# EAGLE design emu (EAGLE 8.2.1)
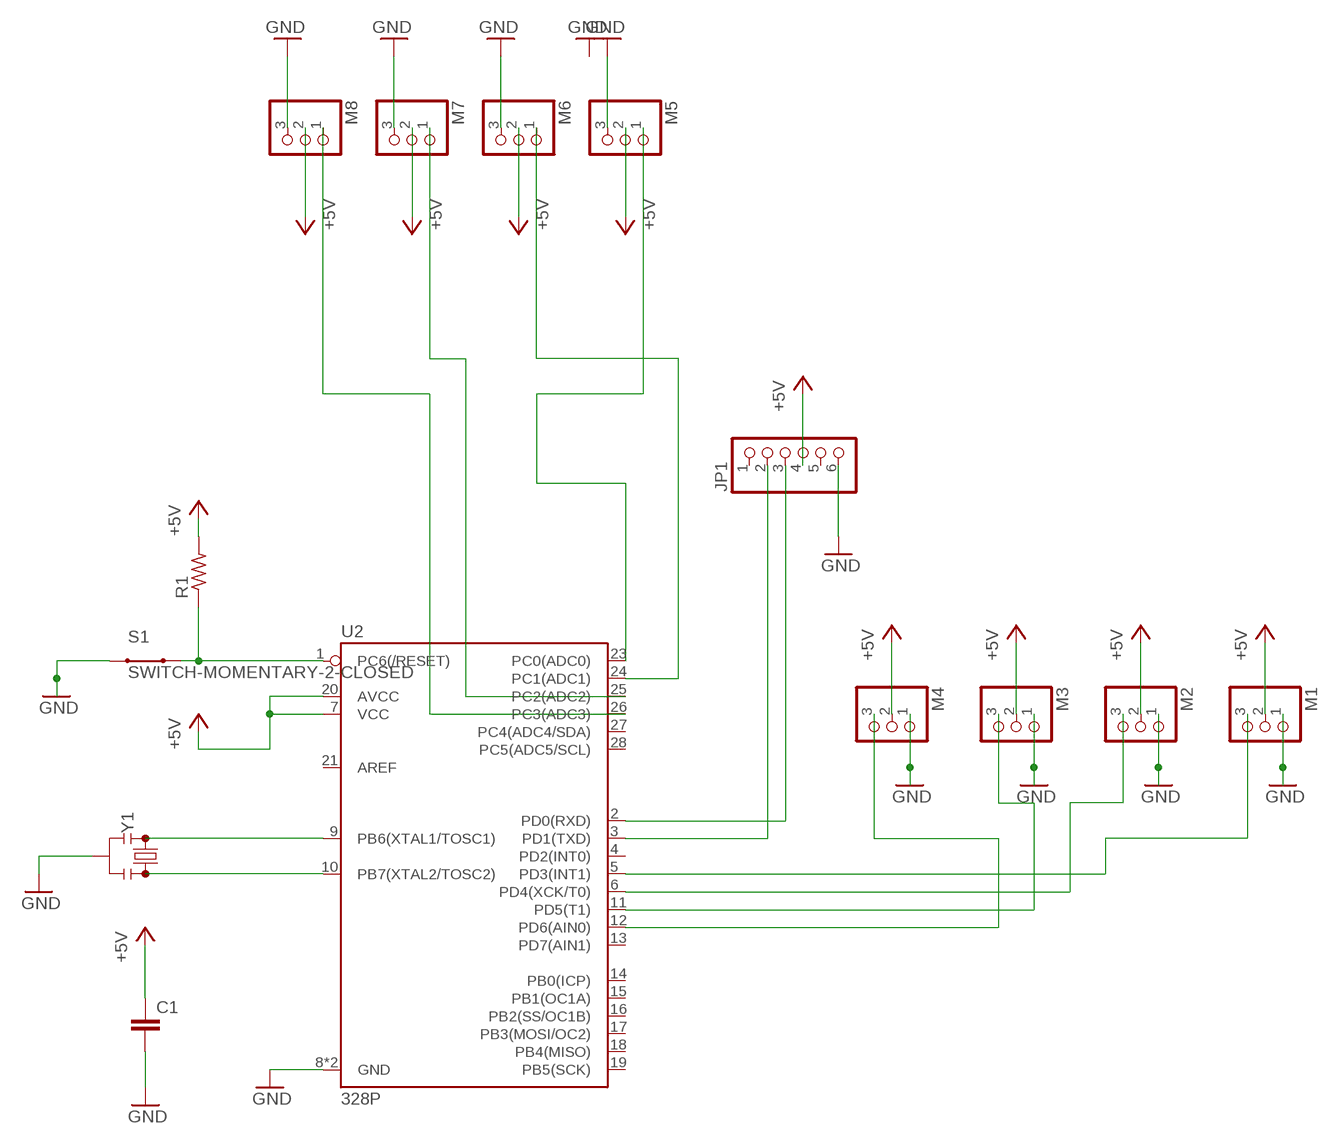
[diagram p0: schematic, sheet 1]

## Parts
C1  C2.5/4  [C2.5-4]
JP1  PINHD-1X6  [1X06]
M1  PINHD-1X3  [1X03]
M2  PINHD-1X3  [1X03]
M3  PINHD-1X3  [1X03]
M4  PINHD-1X3  [1X03]
M5  PINHD-1X3  [1X03]
M6  PINHD-1X3  [1X03]
M7  PINHD-1X3  [1X03]
M8  PINHD-1X3  [1X03]
R1  R-US_0204/7  [0204/7]
S1  SWITCH-MOMENTARY-2-CLOSED  [TACTILE-PTH-12MM]
U2  328P  ATMEGA328P_PDIP  [DIP28]
Y1  RESONATORPTH-7.6X3.8  [RESONATOR-PTH-7.6X3.8]

## Nets
+5V: C1.1 JP1.4 M1.2 M2.2 M3.2 M4.2 M5.2 M6.2 M7.2 M8.2 R1.2 U2.7(VCC) U2.20(AVCC)
GND: C1.2 JP1.6 M1.1 M2.1 M3.1 M4.1 M5.3 M6.3 M7.3 M8.3 S1.1 U2.8(GND) U2.22(GND) Y1.2
N$1: M5.1 U2.23(PC0(ADC0))
N$2: M6.1 U2.24(PC1(ADC1))
N$3: M7.1 U2.25(PC2(ADC2))
N$4: M8.1 U2.26(PC3(ADC3))
N$5: M4.3 U2.12(PD6(AIN0))
N$6: M3.3 U2.11(PD5(T1))
N$7: M2.3 U2.6(PD4(XCK/T0))
N$8: M1.3 U2.5(PD3(INT1))
N$9: R1.1 S1.3 U2.1(PC6(/RESET))
N$10: JP1.3 U2.2(PD0(RXD))
N$12: JP1.2 U2.3(PD1(TXD))
N$13: U2.9(PB6(XTAL1/TOSC1)) Y1.1
N$14: U2.10(PB7(XTAL2/TOSC2)) Y1.3
Unconnected: JP1.1 JP1.5 U2.4(PD2(INT0)) U2.13(PD7(AIN1)) U2.14(PB0(ICP)) U2.15(PB1(OC1A)) U2.16(PB2(SS/OC1B)) U2.17(PB3(MOSI/OC2)) U2.18(PB4(MISO)) U2.19(PB5(SCK)) U2.21(AREF) U2.27(PC4(ADC4/SDA)) U2.28(PC5(ADC5/SCL))

## Library data of the parts
C1 = capacitor-wima:C: CAPACITOR naming: grid - package width
JP1 = pinhead:PINHD-1X6: PIN HEADER
M1-M8 = pinhead:PINHD-1X3: PIN HEADER
R1 = adafruit:R-US_: RESISTOR, American symbol
S1 = SparkFun-Retired:SWITCH-MOMENTARY-2-CLOSED: Closed Switch for tutorial schematics. Not intended for PCB design. Maps to 12mm tact switch, only because eagle won't place a part with no package defined. The ordinary SWITCH-MOMENTARY-2 is likely to be more useful for regular schematics.
U2 = SparkFun-IC-Microcontroller:ATMEGA328P_PDIP: Atmel 328P Through hole ATMEGA328P uC used in the Arduino 32kb flash, 1k EEPROM, 2k SRAM Datasheet <http://www.sparkfun.com/datasheets/Components/SMD/ATMega328.pdf> SparkFun Products Storefront component: AVR 28 Pin 20MHz 32K 6A/D - ATMega328P <https://www.sparkfun.com/products/9061> (COM-09061) SparkFun Simon Says - Through-Hole Soldering Kit <https://www.sparkfun.com/products/10547> (KIT-10547) SparkFun Learn to Solder - Simon Says <https://www.sparkfun.com/products/13708> (KIT-13708) SparkFun BigTime Watch Kit <https://www.sparkfun.com/products/11734> (KIT-11734) SparkFun ClockIt <https://www.sparkfun.com/products/10930> (KIT-10930) SparkFun Serial Enabled LCD Kit <https://www.sparkfun.com/products/10097> (LCD-10097) SparkFun Simon Tilts - Through Hole Soldering Kit <https://www.sparkfun.com/products/12634> (KIT-12634) SparkFun Frequency Counter Kit <https://www.sparkfun.com/products/10140> (KIT-10140) FabFM Radio Kit <https://www.sparkfun.com/products/11043> (KIT-11043) SparkFun Binary Blaster Kit <https://www.sparkfun.com/products/12037> (KIT-12037) SparkFun Metro-Gnome <https://www.sparkfun.com/products/9236> (KIT-09236) ATmega328 with Arduino Optiboot (Uno) <https://www.sparkfun.com/products/10524> (DEV-10524); PROD_ID: IC-09136
Y1 = SparkFun-Clocks:RESONATOR: Resonators (Generic) Ceramic resonators are clock-generating components, often used to control timing in microcontrollers. They usually have 3 pins: two pins for oscillation, and one pin for ground. Compared to crystals, resonators have worse tolerance, but are usually much cheaper. Plus, they have built-in load capacitors! These devices are used on boards like the Arduino Pro 8MHz <https://www.sparkfun.com/products/11114> and Arduino Pro 16MHz <https://www.sparkfun.com/products/11113>.

## Board
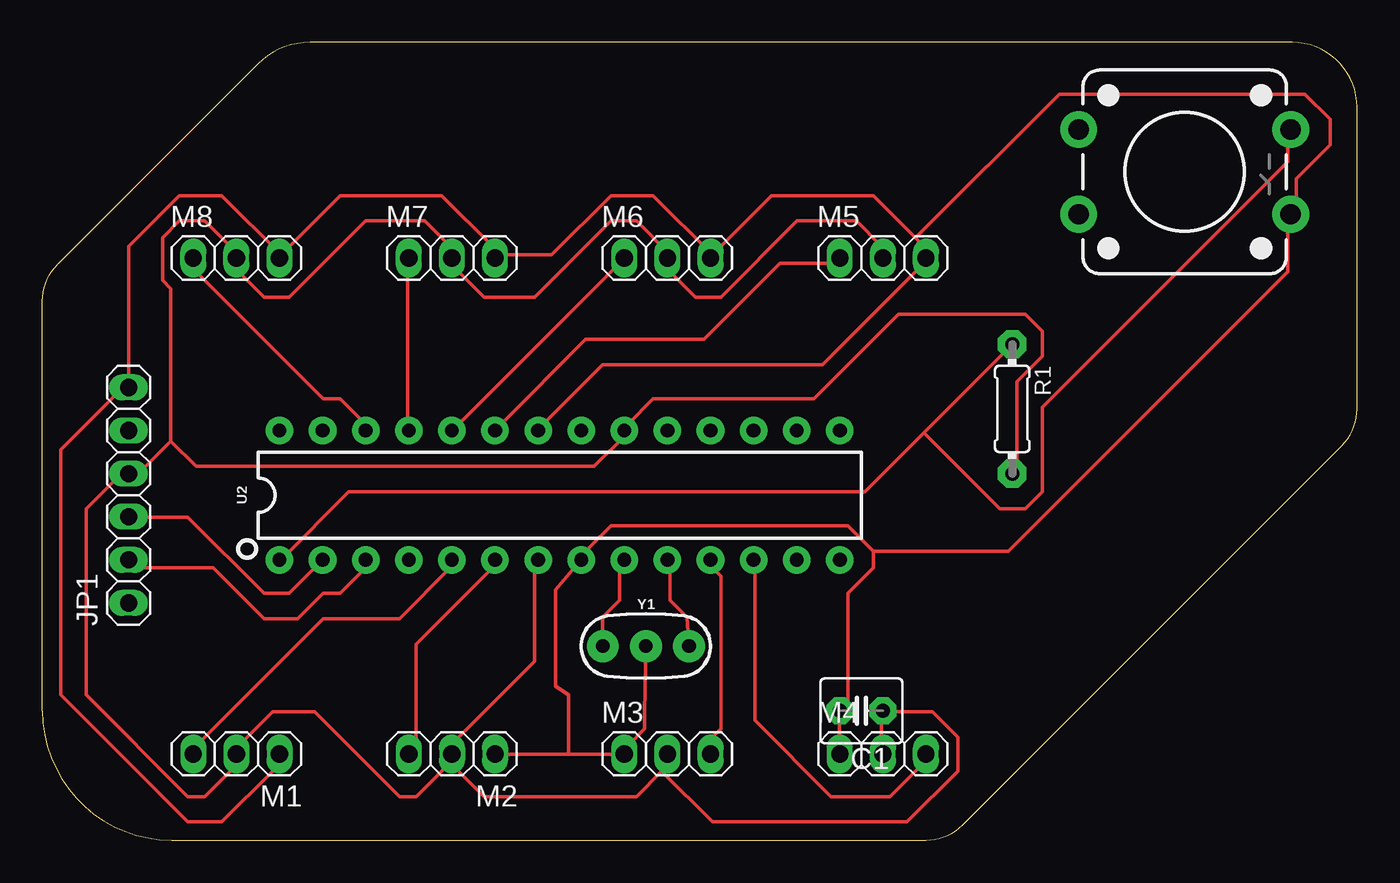
[diagram p1: board, top side]

Size 77.47 x 46.99 mm. Coordinates in mm from the lower left corner, seen from the top.
Outline: 0,7.62 0,31.75 arc-45 0.9,33.92 12.7,45.72 arc-45 15.77,46.99 73.66,46.99 arc-90 77.47,43.18 77.47,25.4 arc-45 76.57,23.23 54.24,0.9 arc-45 52.07,0 7.62,0 arc-90 0,7.62
Copper layers (1*16): Top 0.035mm / dielectric 1.5mm / Bottom 0.035mm
Design rules "OthermillDRC_1_32_v2": minimum track width 8mil, minimum drill 0.8mm, track to track 0.794003125mm, track to pad 0.794003125mm, pad to pad 0.794003125mm, via to via 0.794003125mm, smd to smd 0mil, copper to edge 0mil, drill to drill 1mil, minimum pad ring 10mil, minimum via ring 10mil, stop-mask expansion 1mil, vias tented up to drill 30mil, thermal gap 10mil

### Footprints (pad centres in the part's own frame; a part is rotated, then mirrored left to right if it is on the bottom)
C2.5-4 = drill 0.813 pad 1.6 octagon: 1 -1.27,0; 2 1.27,0
1X06 = drill 1.016 long: 1 -6.35,0; 2 -3.81,0; 3 -1.27,0; 4 1.27,0; 5 3.81,0; 6 6.35,0
1X03 = drill 1.016 long: 1 -2.54,0; 2 0,0; 3 2.54,0
0204/7 = drill 0.813 pad 1.676 octagon: 1 -3.81,0; 2 3.81,0
TACTILE-PTH-12MM = drill 1.2 pad 2.159: 1 6.25,-2.5; 2 -6.25,-2.5; 3 6.25,2.5; 4 -6.25,2.5
DIP28 = drill 0.813 pad 1.626: 1 -16.51,-3.81; 2 -13.97,-3.81; 3 -11.43,-3.81; 4 -8.89,-3.81; 5 -6.35,-3.81; 6 -3.81,-3.81; 7 -1.27,-3.81; 8 1.27,-3.81; 9 3.81,-3.81; 10 6.35,-3.81; 11 8.89,-3.81; 12 11.43,-3.81; 13 13.97,-3.81; 14 16.51,-3.81; 15 16.51,3.81; 16 13.97,3.81; 17 11.43,3.81; 18 8.89,3.81; 19 6.35,3.81; 20 3.81,3.81; 21 1.27,3.81; 22 -1.27,3.81; 23 -3.81,3.81; 24 -6.35,3.81; 25 -8.89,3.81; 26 -11.43,3.81; 27 -13.97,3.81; 28 -16.51,3.81
RESONATOR-PTH-7.6X3.8 = drill 0.8 pad 1.88: 1 -2.54,0; 2 0,0; 3 2.54,0

### Placement (x,y rotation side)
C1  48.26,7.62 180 top
JP1  5.08,20.32 90 top
M1  11.43,5.08 180 top
M2  24.13,5.08 180 top
M3  36.83,5.08 0 top
M4  49.53,5.08 0 top
M5  49.53,34.29 0 top
M6  36.83,34.29 0 top
M7  24.13,34.29 0 top
M8  11.43,34.29 0 top
R1  57.15,25.4 270 top
S1  67.31,39.37 0 top
U2  30.48,20.32 0 top
Y1  35.56,11.43 0 top

### Tracks (layer width: path | path; a pad name or v marks a point on that pad's centre or on a via)
+5V
  Top 0.203: M4.2 49.45,5.56 49.45,7.55 C1.1 49.95,7.55 52.45,7.55 53.94,6.06 53.94,4.06 50.95,1.07 39.48,1.07 36.49,4.06 | 24.03,4.56 24.52,5.06 M2.2 | 24.03,4.56 22.03,2.57 21.04,2.57 16.05,7.55 13.56,7.55 11.56,5.56 M1.2 11.06,5.06 11.06,4.06 9.57,2.57 8.57,2.57 2.59,8.55 2.59,19.52 5.08,22.01 | 36.49,4.06 36.49,5.06 M3.2 36.49,4.06 | 36.49,4.06 35,2.57 26.02,2.57 24.03,4.56 | 24.03,4.56 M2.2 | U2.7 29.01,16.03 29.01,10.55 24.03,5.56 M2.2 | M5.2 49.45,34.48 49.45,34.98 47.96,36.47 44.47,36.47 39.98,31.99 38.49,31.99 36.49,33.98 M6.2 36.99,34.48 35,36.47 33.5,36.47 29.01,31.99 26.02,31.99 24.52,33.48 24.52,33.98 M7.2 24.03,34.48 24.03,34.98 22.53,36.47 19.04,36.47 14.55,31.99 13.06,31.99 11.06,33.98 M8.2 11.56,34.48 9.57,36.47 8.07,36.47 7.07,35.48 7.07,32.98 7.57,32.48 7.57,23.51 | 5.08,22.01 6.08,22.01 7.57,23.51 | 7.57,23.51 9.07,22.01 32.5,22.01 34,23.51 34,24.01 U2.20 34.5,24.51 35.99,26 45.47,26 50.45,30.99 57.93,30.99 58.93,29.99 58.93,28.5 57.43,27 57.43,22.01 R1.2 | 5.08,22.01 JP1.4
GND
  Top 0.203: M4.1 46.96,5.56 46.96,7.55 C1.2 47.46,8.05 47.46,14.54 48.96,16.03 48.96,17.03 | 31.01,5.06 34,5.06 M3.1 34.5,5.56 35.49,6.56 35.49,7.55 Y1.2 | 31.01,5.06 27.02,5.06 M2.1 | 31.01,5.06 31.01,8.55 30.24,9.05 30.24,14.76 U2.8 31.51,16.53 33.5,18.52 47.46,18.52 48.96,17.03 | 48.96,17.03 56.93,17.03 73.39,33.48 73.39,36.47 S1.1 73.89,36.97 73.89,38.97 75.88,40.96 75.88,42.46 74.39,43.95 59.93,43.95 51.45,35.48 | 39.48,34.48 35.99,37.97 33.5,37.97 30.01,34.48 27.02,34.48 M7.3 26.52,34.48 26.52,34.98 23.53,37.97 17.55,37.97 14.05,34.48 | 51.45,35.48 48.96,37.97 42.97,37.97 39.48,34.48 | 51.45,35.48 51.95,34.98 51.95,34.48 M5.3 51.95,33.98 45.96,28 33,28 29.51,24.51 U2.22 | 39.48,34.48 M6.3 | 5.08,27 5.08,34.98 8.07,37.97 10.57,37.97 14.05,34.48 | 5.08,27 1.09,23.01 1.09,8.55 8.57,1.07 10.57,1.07 13.56,4.06 13.56,5.06 M1.1 | 5.08,27 JP1.6 | 14.05,34.48 M8.3
N$1
  Top 0.203: M5.1 46.96,33.98 43.47,33.98 38.98,29.49 32,29.49 27.02,24.51 U2.23
N$2
  Top 0.203: M6.1 34,33.98 24.52,24.51 U2.24
N$3
  Top 0.203: M7.1 21.53,33.98 21.53,24.51 U2.25
N$4
  Top 0.203: M8.1 9.07,33.98 9.07,33.48 16.55,26 17.55,26 19.04,24.51 U2.26
N$5
  Top 0.203: M4.3 51.95,5.06 51.95,4.56 49.95,2.57 46.46,2.57 41.98,7.06 41.98,16.03 U2.12
N$6
  Top 0.203: M3.3 39.48,5.56 39.48,6.06 39.98,6.56 39.98,15.53 39.48,16.03 U2.11
N$7
  Top 0.203: M2.3 22.03,5.56 22.03,11.54 26.52,16.03 U2.6
N$8
  Top 0.203: M1.3 9.07,5.56 16.55,13.04 21.04,13.04 24.03,16.03 U2.5
N$9
  Top 0.203: R1.1 51.95,24.01 | 51.95,24.01 48.46,20.52 18.04,20.52 14.05,16.53 U2.1 | 51.95,24.01 56.44,19.52 57.93,19.52 58.93,20.52 58.93,25.5 73.39,39.96 73.39,41.46 S1.3
N$10
  Top 0.203: JP1.3 5.08,19.02 8.57,19.02 13.06,14.54 14.55,14.54 16.05,16.03 U2.2
N$12
  Top 0.203: JP1.2 5.08,16.03 10.07,16.03 13.06,13.04 15.05,13.04 16.55,14.54 17.55,14.54 19.04,16.03 U2.3
N$13
  Top 0.203: U2.9 34,16.03 34,14.13 33,13.13 Y1.1
N$14
  Top 0.203: U2.10 36.99,16.03 36.99,14.13 37.99,13.13 Y1.3